# Altium project RT_SUPER_EXT2.PrjPcb
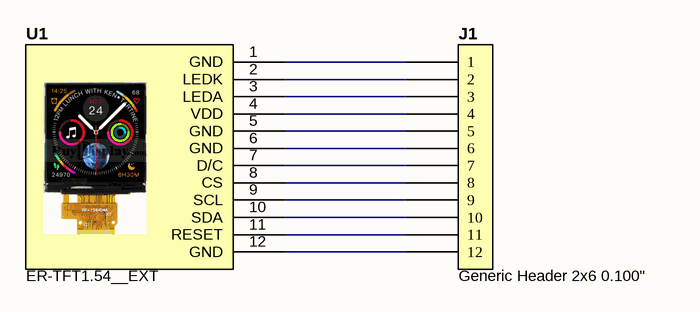
[diagram p0: RT_SUPER_EXT2.SchDoc]
SCH_DATE: 2022-11-25; PROJECT_TITLE_LINE_1: RT_SUPER_EXT2; PROJECT_STATUS: PROTOTYPE; PROJECT_ENGINEER: E. Hughes; PCB_VERSION: A; PCB_TITLE: RT_SUPER_EXT2; PCB_SOLDER_MASK_COLOR_TOP: BLACK; PCB_SOLDER_MASK_COLOR_BOTTOM: BLACK; PCB_SILKSCREEN_COLOR_TOP: WHITE; PCB_SILKSCREEN_COLOR_BOTTOM: WHITE; PCB_PRINTOUT_SCALE: 1:1; PCB_PART_NUMBER: RT_SUPER_EXT2; PCB_MIN_TRACE_WIDTH: 5; PCB_MIN_TRACE_SPACE: 5; PCB_MIN_DRILL: 6; PCB_MATERIAL: FR4; PCB_LAYERS: 4; PCB_FINISH_PLATING: GOLD ENIG; PCB_FINISHED_THICKNESS: 31.25; PCB_DRC_DATE: X; PCB_COPPER_WEIGHT_OUTER: 1oz; PCB_COPPER_WEIGHT_INNER: 1oz; CCA_TITLE: RT_SUPER_EXT2; CCA_PART_NUMBER: RT_SUPER_EXT2; BOM_NOTES_LINE_4: -; BOM_NOTES_LINE_3: -; BOM_NOTES_LINE_2: -; BOM_NOTES_LINE_1: -; APPROVAL_REVIEWED_DATE: -; APPROVAL_REVIEWED: -; APPROVAL_ENGINEER_DATE: -; APPROVAL_ENGINEER: -; APPROVAL_DRAWN_DATE: -; APPROVAL_DRAWN: -; APPROVAL_CHECKED_DATE: -; APPROVAL_APPROVED_2_DATE: -; APPROVAL_APPROVED_2: -; APPROVAL_APPROVED_1_DATE: -; APPROVAL_APPROVED_1: -
1 sheet, 2 parts. Net scope: global (net labels, ports and power ports of the same name join across sheets).
Board file: RT_SUPER_EXT2.PCBdoc

## Sheet RT_SUPER_EXT2.SchDoc
size A

### Parts
J1  Generic Header 2x6 0.100"  [HEADER 2x6 .100"]
U1  ER-TFT1.54__EXT  [ER-TFT1.54-1 - EXT]

### Nets
NetJ1_1: J1.1 U1.1(GND)
NetJ1_2: J1.2 U1.2(LEDK)
NetJ1_3: J1.3 U1.3(LEDA)
NetJ1_4: J1.4 U1.4(VDD)
NetJ1_5: J1.5 U1.5(GND)
NetJ1_6: J1.6 U1.6(GND)
NetJ1_7: J1.7 U1.7(D/C)
NetJ1_8: J1.8 U1.8(CS)
NetJ1_9: J1.9 U1.9(SCL)
NetJ1_10: J1.10 U1.10(SDA)
NetJ1_11: J1.11 U1.11(RESET)
NetJ1_12: J1.12 U1.12(GND)

### Library data of the parts
J1 = HEADER_12: Value: Generic Header 2x6 0.100"; ComponentLink6URL: https://datasheet.ciiva.com/23923/1747739-23923127.pdf; ComponentLink6Description: https://datasheet.ciiva.com/23923/1747739-23923127.pdf; ComponentLink7URL: https://datasheet.ciiva.com/10083/0901200130-pcb-headers-10083978.pdf; ComponentLink7Description: https://datasheet.ciiva.com/10083/0901200130-pcb-headers-10083978.pdf; ComponentLink8URL: https://datasheet.ciiva.com/26307/cgrid-iii-eng-tds-26307658.pdf; ComponentLink8Description: https://datasheet.ciiva.com/26307/cgrid-iii-eng-tds-26307658.pdf; ComponentLink9URL: https://datasheet.ciiva.com/5151/0901200130-pcb-headers-230424-5151183.pdf; ComponentLink9Description: https://datasheet.ciiva.com/5151/0901200130-pcb-headers-230424-5151183.pdf
U1 = ER-TFT1.54__EXT: EXTENTION FOOTPRINT; Manufacturer: Buy Display; Manufacturer Part Number: ER-TFT1.54-1; Value: ER-TFT1.54__EXT

## Assembly variants
A: all parts fitted